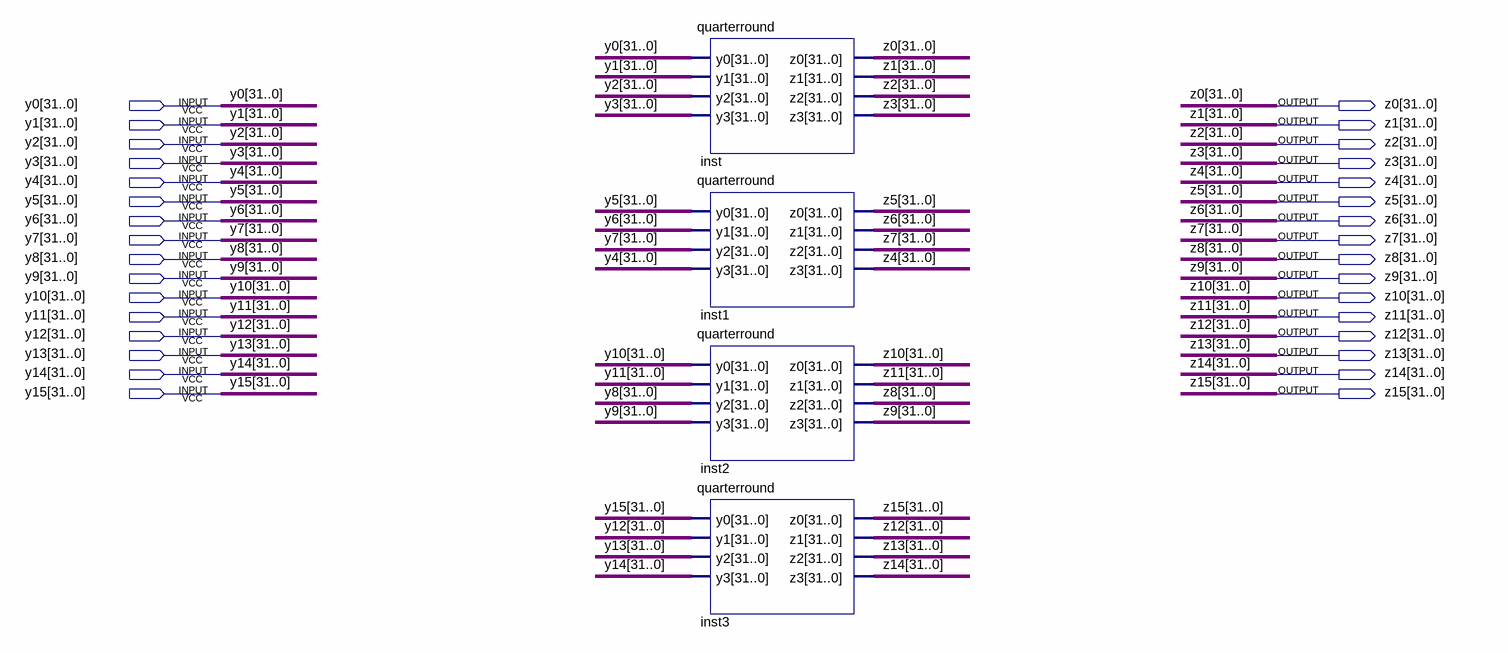
[diagram p0: schematic sheet]
// Quartus schematic rowround.bdf as structural Verilog: 4 symbols, 32 pins
module rowround (
  input  [31:0] y0,
  input  [31:0] y1,
  input  [31:0] y2,
  input  [31:0] y3,
  input  [31:0] y4,
  input  [31:0] y5,
  input  [31:0] y6,
  input  [31:0] y7,
  input  [31:0] y8,
  input  [31:0] y9,
  input  [31:0] y10,
  input  [31:0] y11,
  input  [31:0] y12,
  input  [31:0] y13,
  input  [31:0] y14,
  input  [31:0] y15,
  output [31:0] z0,
  output [31:0] z1,
  output [31:0] z2,
  output [31:0] z3,
  output [31:0] z4,
  output [31:0] z5,
  output [31:0] z6,
  output [31:0] z7,
  output [31:0] z8,
  output [31:0] z9,
  output [31:0] z10,
  output [31:0] z11,
  output [31:0] z12,
  output [31:0] z13,
  output [31:0] z14,
  output [31:0] z15
);

  quarterround inst (.y0(y0), .y1(y1), .y2(y2), .y3(y3), .z0(z0), .z1(z1), .z2(z2), .z3(z3));
  quarterround inst1 (.y0(y5), .y1(y6), .y2(y7), .y3(y4), .z0(z5), .z1(z6), .z2(z7), .z3(z4));
  quarterround inst2 (.y0(y10), .y1(y11), .y2(y8), .y3(y9), .z0(z10), .z1(z11), .z2(z8), .z3(z9));
  quarterround inst3 (.y0(y15), .y1(y12), .y2(y13), .y3(y14), .z0(z15), .z1(z12), .z2(z13), .z3(z14));
endmodule
